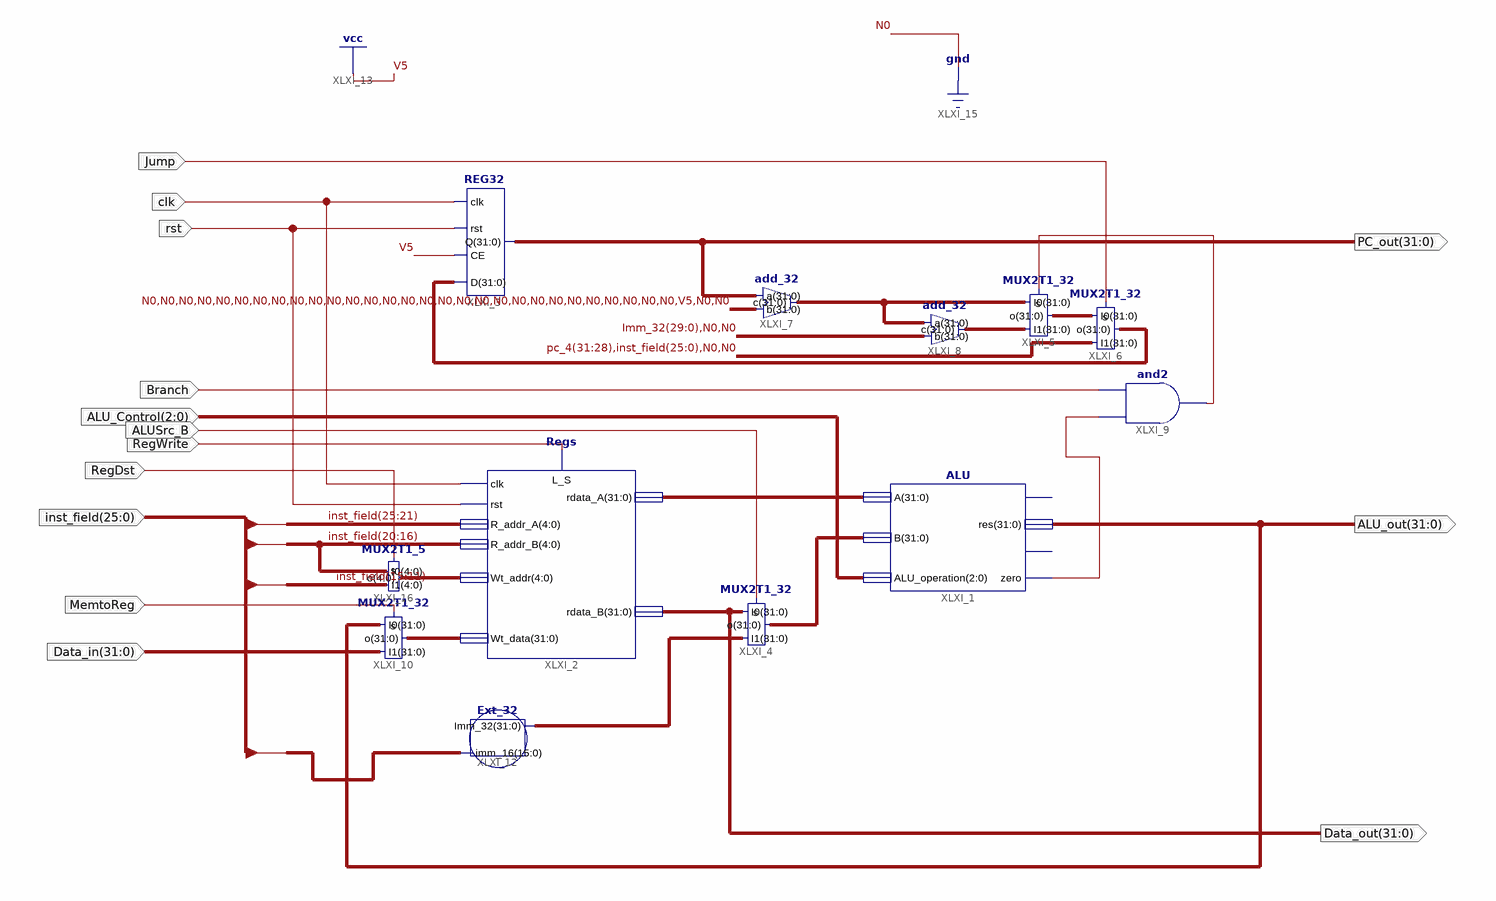
[diagram p0: schematic sheet 1]
// Xilinx ISE schematic Data_path.sch (kintex7) as structural Verilog: 12 symbols, 14 ports
module Data_path (
  input  MemtoReg,
  input  [31:0] Data_in,
  input  [2:0] ALU_Control,
  input  Branch,
  input  RegWrite,
  input  rst,
  input  clk,
  input  [25:0] inst_field,
  input  RegDst,
  input  ALUSrc_B,
  input  Jump,
  output [31:0] Data_out,
  output [31:0] PC_out,
  output [31:0] ALU_out
);

  wire XLXN_14, XLXN_15;
  wire [4:0] XLXN_16;
  wire [31:0] branch_pc, Imm_32, pc_4, XLXN_1, XLXN_3, XLXN_12, XLXN_17, XLXN_27;

  ALU XLXI_1 (
    .A(XLXN_1), .B(XLXN_3), .ALU_operation(ALU_Control), .res(ALU_out), .zero(XLXN_14));  // open: Co, overflew
  Regs XLXI_2 (
    .clk(clk), .L_S(RegWrite), .rdata_A(XLXN_1), .rst(rst), .Wt_data(XLXN_17), .rdata_B(Data_out),
    .R_addr_A(inst_field[25:21]), .R_addr_B(inst_field[20:16]), .Wt_addr(XLXN_16));
  REG32 XLXI_3 (.D(XLXN_27), .CE(1'b1), .rst(rst), .clk(clk), .Q(PC_out));
  MUX2T1_32 XLXI_4 (.s(ALUSrc_B), .I0(Data_out), .I1(Imm_32), .o(XLXN_3));
  MUX2T1_32 XLXI_5 (.s(XLXN_15), .I0(pc_4), .I1(branch_pc), .o(XLXN_12));
  add_32 XLXI_7 (.b(32'b00000000000000000000000000000100), .a(PC_out), .c(pc_4));
  add_32 XLXI_8 (.b({Imm_32[29:0], 2'b00}), .a(pc_4), .c(branch_pc));
  and XLXI_9 (XLXN_15, XLXN_14, Branch);
  MUX2T1_32 XLXI_10 (.s(MemtoReg), .I0(ALU_out), .I1(Data_in), .o(XLXN_17));
  Ext_32 XLXI_12 (.imm_16(inst_field[15:0]), .Imm_32(Imm_32));
  MUX2T1_32 XLXI_6 (.s(Jump), .I0(XLXN_12), .I1({pc_4[31:28], inst_field, 2'b00}), .o(XLXN_27));
  MUX2T1_5 XLXI_16 (.I1(inst_field[15:11]), .I0(inst_field[20:16]), .o(XLXN_16), .s(RegDst));
endmodule
